# Altium schematic sheet ROV_SensorBoard.SchDoc
size A4; SheetNumber: 1; SheetTotal: 1
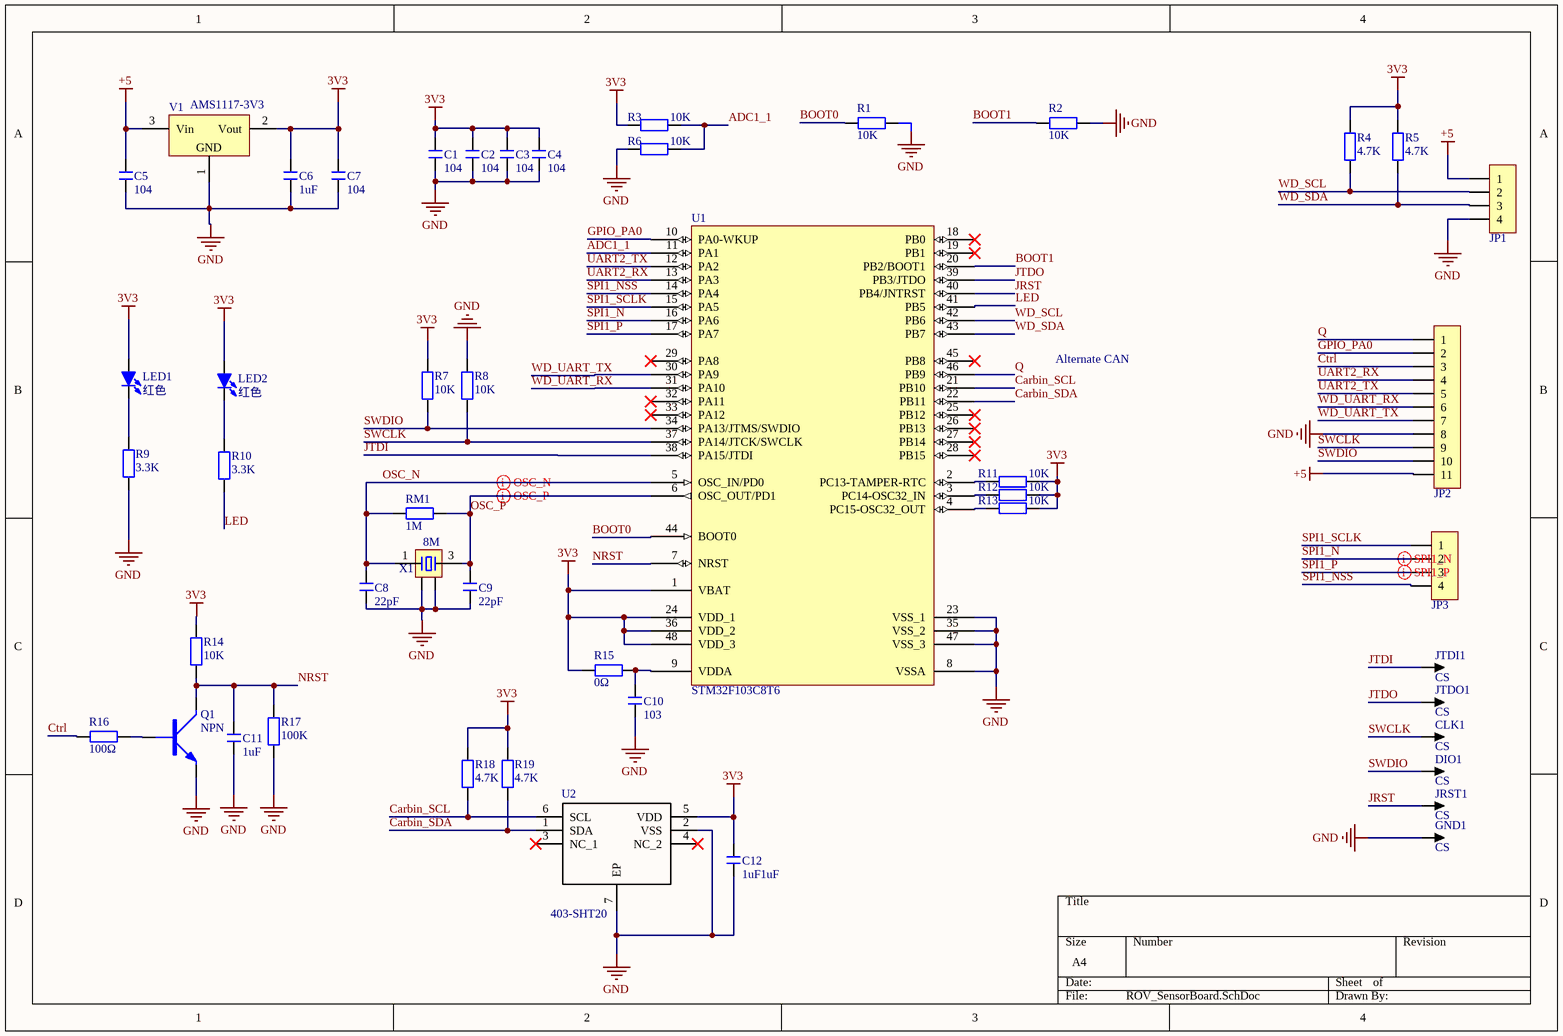
[diagram p0: ROV_SensorBoard.SchDoc]

## Parts
C1  104  [C 0603_L]
C2  104  [C 0603_L]
C3  104  [C 0603_L]
C4  104  [C 0603_L]
C5  104  [C 0603_L]
C6  1uF  [C 0603_L]
C7  104  [C 0603_L]
C8  22pF  [C 0603_L]
C9  22pF  [C 0603_L]
C10  103  [C 0603_L]
C11  1uF  [C 0603_L]
C12  1uF1uF  [C 0603_L]
CLK1  CS  [R100]
DIO1  CS  [R100]
GND1  CS  [R100]
JP1  HDR-1X4  [MX 1.25-LS-4P]  (value not drawn)
JP2  HDR-1X11  [HDR2.54-LI-11P]  (value not drawn)
JP3  HDR-1X4  [HDR2.54-LI-4P]  (value not drawn)
JRST1  CS  [R100]
JTDI1  CS  [R100]
JTDO1  CS  [R100]
LED1  红色  [LED 0603W]
LED2  红色  [LED 0603W]
Q1  NPN  [SOT-23]
R1  10K  [R 0603_L]
R2  10K  [R 0603_L]
R3  10K  [R 0603_L]
R4  4.7K  [R 0603_L]
R5  4.7K  [R 0603_L]
R6  10K  [R 0603_L]
R7  10K  [R 0603_L]
R8  10K  [R 0603_L]
R9  3.3K  [R 0603_L]
R10  3.3K  [R 0603_L]
R11  10K  [R 0603_L]
R12  10K  [R 0603_L]
R13  10K  [R 0603_L]
R14  10K  [R 0603_L]
R15  0Ω  [R 0603_L]
R16  100Ω  [R 0603_L]
R17  100K  [R 0603_L]
R18  4.7K  [R 0603_L]
R19  4.7K  [R 0603_L]
RM1  1M  [R 0603_L]
U1  STM32F103C8T6  [LQFP48 7X7]
U2  Mouser Part Number: 403-SHT20  [SON100P300X300X110-7N]  (hidden comment: SHT20)
V1  AMS1117-3V3  [SOT89_N]
X1  8M  [OSC 5032-4P]

## Nets
3V3: C1.2 C2.2 C3.2 C4.2 C6.2 C7.2 C12.2 LED1.1(A) LED2.1(A) R3.2 R4.2 R5.2 R7.1 R11.1 R12.1 R13.1 R14.1 R15.2 R18.2 R19.2 U1.1(VBAT) U1.24(VDD_1) U1.36(VDD_2) U1.48(VDD_3) U2.5(VDD) V1.2(Vout)
+5: C5.2 JP1.1 JP2.11 V1.3(Vin)
GND: C1.1 C2.1 C3.1 C4.1 C5.1 C6.1 C7.1 C8.1 C9.1 C10.1 C11.1 C12.1 GND1.1 JP1.4 JP2.8 Q1.E R1.1 R2.1 R6.2 R8.1 R9.1 R17.2 U1.8(VSSA) U1.23(VSS_1) U1.35(VSS_2) U1.47(VSS_3) U2.2(VSS) U2.7(EP) V1.1(GND) X1.2 X1.4
ADC1_1: R3.1 R6.1 U1.11(PA1)
BOOT0: R1.2 U1.44(BOOT0)
BOOT1: R2.2 U1.20(PB2/BOOT1)
Carbin_SCL: R18.1 U1.21(PB10) U2.6(SCL)
Carbin_SDA: R19.1 U1.22(PB11) U2.1(SDA)
Ctrl: JP2.3 R16.2
GPIO_PA0: JP2.2 U1.10(PA0-WKUP)
JRST: JRST1.1 U1.40(PB4/JNTRST)
JTDI: JTDI1.1 U1.38(PA15/JTDI)
JTDO: JTDO1.1 U1.39(PB3/JTDO)
LED: R10.1 U1.41(PB5)
NRST: C11.2 Q1.C R14.2 R17.1 U1.7(NRST)
OSC_N: C8.2 RM1.2 U1.5(OSC_IN/PD0) X1.1
OSC_P: C9.2 RM1.1 U1.6(OSC_OUT/PD1) X1.3
Q: JP2.1 U1.46(PB9)
SPI1_N: JP3.2 U1.16(PA6)
SPI1_NSS: JP3.4 U1.14(PA4)
SPI1_P: JP3.3 U1.17(PA7)
SPI1_SCLK: JP3.1 U1.15(PA5)
SWCLK: CLK1.1 JP2.9 R8.2 U1.37(PA14/JTCK/SWCLK)
SWDIO: DIO1.1 JP2.10 R7.2 U1.34(PA13/JTMS/SWDIO)
UART2_RX: JP2.4 U1.13(PA3)
UART2_TX: JP2.5 U1.12(PA2)
WD_SCL: JP1.2 R4.1 U1.42(PB6)
WD_SDA: JP1.3 R5.1 U1.43(PB7)
WD_UART_RX: JP2.6 U1.31(PA10)
WD_UART_TX: JP2.7 U1.30(PA9)
NetC10_2: C10.2 R15.1 U1.9(VDDA)
NetLED1_2: LED1.2(K) R9.2
NetLED2_2: LED2.2(K) R10.2
NetQ1_B: Q1.B R16.1
NetR11_2: R11.2 U1.2(PC13-TAMPER-RTC)
NetR12_2: R12.2 U1.3(PC14-OSC32_IN)
NetR13_2: R13.2 U1.4(PC15-OSC32_OUT)

Not connected (* = marked no-connect by the designer): U1 18(PB0)* 19(PB1)* 25(PB12)* 26(PB13)* 27(PB14)* 28(PB15)* 29(PA8)* 32(PA11)* 33(PA12)* 45(PB8)*; U2 3(NC_1)* 4(NC_2)*

## Layout directives
differential pair: OSC_N, OSC_P, SPI1_N, SPI1_P

## Notes on the sheet
- Alternate CAN

## Library data of the parts
C1-C12 = C: 无极性贴片电容; 版权归属: 源创客; BOM名称: 无极性贴片电容; 学习资源: www.ooocke.com
CLK1 DIO1 GND1 JRST1 JTDI1 JTDO1 = CS: 探针焊盘; 版权归属: 源创客; BOM名称: 探针焊盘; 学习资源: www.ooocke.com
JP1 JP3 = Header 4: 4P接插件; 版权归属: 源创客; BOM名称: 4P接插件; 学习资源: www.ooocke.com
JP2 = Header 11: 11P接插件; 版权归属: 源创客; BOM名称: 11P接插件; 学习资源: www.ooocke.com
LED1 LED2 = LED-SMD: 贴片LED; 版权归属: 源创客; BOM名称: 贴片LED; 学习资源: www.ooocke.com
Q1 = NPN: NPN三极管
R1-R19 RM1 = R: 贴片电阻; 版权归属: 源创客; BOM名称: 贴片电阻; 学习资源: www.ooocke.com
U2 = SHT20: 温湿度传感器; Manufacturer_Name: Sensirion; Datasheet Link: https://www.sensirion.com/fileadmin/user_upload/customers/sensirion/Dokumente/2_Humidity_Sensors/Sensirion_Humidity_Sensors_SHT20_Datasheet.pdf; Height: 1.1mm; Manufacturer_Part_Number: SHT20; Mouser Price/Stock: https://www.mouser.com/Search/Refine.aspx?Keyword=403-SHT20; RS Part Number: 1237351P; RS Price/Stock: http://uk.rs-online.com/web/p/products/1237351P
V1 = AMS1117: 三端稳压芯片; BOM名称: 稳压芯片; 版权归属: 源创客; 学习资源: www.ooocke.com
X1 = XTAL-4P: 4脚无源晶振; 版权归属: 源创客; BOM名称: 4脚无源晶振; 学习资源: www.ooocke.com